# Altium schematic sheet SCH_System.SchDoc
size A4
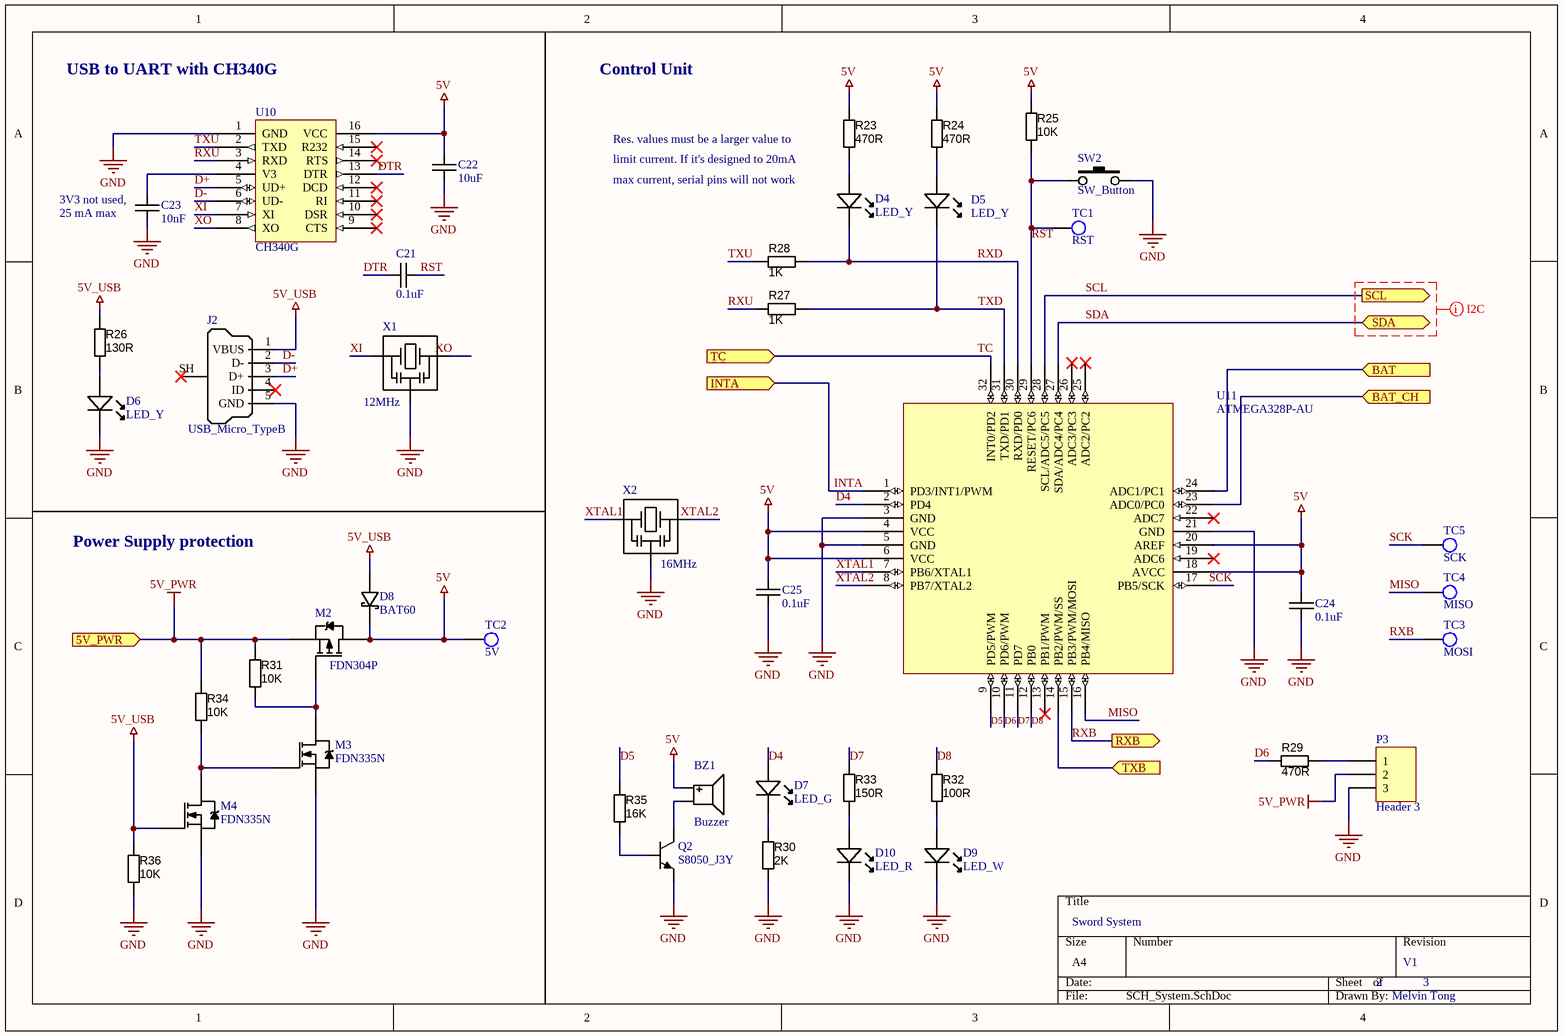
[diagram p0: SCH_System.SchDoc]

## Parts
BZ1  Buzzer  [Buzzer]
C21  0.1uF  [CAP_0805]
C22  10uF  [CAP_1206]
C23  10nF  [CAP_0805]
C24  0.1uF  [CAP_0805]
C25  0.1uF  [CAP_0805]
D4  LED_Y  [LED-0603-YELLOW]
D5  LED_Y  [LED-0603-YELLOW]
D6  LED_Y  [LED-0603-YELLOW]
D7  LED_G  [LED_0805]
D8  BAT60  [SOD323]
D9  LED_W  [LED_0805]
D10  LED_R  [LED_0805]
J2  USB_Micro_TypeB  [USB_Micro_TypeB]
M2  FDN304P  [SOT23_213]
M3  FDN335N  [SOT23_213]
M4  FDN335N  [SOT23_213]
P3  Header 3  [HDR1X3]
Q2  S8050_J3Y  [SOT23_213]
R23  470R  [RESC3216X70N]
R24  470R  [RESC3216X70N]
R25  10K  [RESC3216X70N]
R26  130R  [RESC3216X70N]
R27  1K  [RESC3216X70N]
R28  1K  [RESC3216X70N]
R29  470R  [RESC3216X70N]
R30  2K  [RESC3216X70N]
R31  10K  [RESC3216X70N]
R32  100R  [RESC3216X70N]
R33  150R  [RESC3216X70N]
R34  10K  [RESC3216X70N]
R35  16K  [RESC3216X70N]
R36  10K  [RESC3216X70N]
SW2  SW_Button  [Button_4x4x1.5]
TC1  RST  [TP_15]
TC2  5V  [TP_15]
TC3  MOSI  [TP_15]
TC4  MISO  [TP_15]
TC5  SCK  [TP_15]
U10  CH340G  [CH340G]
U11  ATMEGA328P-AU  [ATMEGA328P-AU]
X1  12MHz  [XTAL_3.2x1.6]
X2  16MHz  [XTAL_16MHz]

## Ports
5V_PWR (in), BAT (in), BAT_CH (in), INTA (in), RXB (out), SCL (out), SDA (bidir), TC (in), TXB (in)

## Nets
5V: BZ1.1(Positive) C22.1 C24.2 C25.2 D8.K M2.3(D) R23.2 R24.1 R25.1 TC2.1 U10.16(VCC) U11.4(VCC) U11.6(VCC) U11.18(AVCC) U11.20(AREF)
5V_PWR: M2.2(S) P3.2 R31.1 R34.1 ; port 5V_PWR
5V_USB: D8.A J2.1(VBUS) M4.1(G) R26.2 R36.1
GND: C22.2 C23.2 C24.1 C25.1 D6.K D9.K D10.K J2.5(GND) M3.2(S) M4.2(S) P3.3 Q2.2(E) R30.2 R36.2 SW2.2 U10.1(GND) U11.3(GND) U11.5(GND) U11.21(GND) X1.2(GND) X2.2(GND)
BAT: U11.24(ADC1/PC1) ; port BAT
BAT_CH: U11.23(ADC0/PC0) ; port BAT_CH
D4: D7.A U11.2(PD4)
D5: R35.1 U11.9(PD5/PWM)
D6: R29.2 U11.10(PD6/PWM)
D7: R33.1 U11.11(PD7)
D8: R32.2 U11.12(PB0)
D+: J2.3(D+) U10.5(UD+)
D-: J2.2(D-) U10.6(UD-)
DTR: C21.1 U10.13(DTR)
INTA: U11.1(PD3/INT1/PWM) ; port INTA
MISO: TC4.1 U11.16(PB4/MISO)
RST: C21.2 R25.2 SW2.1 TC1.1 U11.29(RESET/PC6)
RXB: TC3.1 U11.15(PB3/PWM/MOSI) ; port RXB
RXD: D4.K R28.2 U11.30(RXD/PD0)
RXU: R27.1 U10.3(RXD)
SCK: TC5.1 U11.17(PB5/SCK)
SCL: U11.28(SCL/ADC5/PC5) ; port SCL
SDA: U11.27(SDA/ADC4/PC4) ; port SDA
TC: U11.32(INT0/PD2) ; port TC
TXB: U11.14(PB2/PWM/SS) ; port TXB
TXD: D5.K R27.2 U11.31(TXD/PD1)
TXU: R28.1 U10.2(TXD)
XI: U10.7(XI) X1.1(IN)
XO: U10.8(XO) X1.3(OUT)
XTAL1: U11.7(PB6/XTAL1) X2.1(IN)
XTAL2: U11.8(PB7/XTAL2) X2.3(OUT)
NetBZ1_2: BZ1.2(Negative) Q2.3(C)
NetC23_1: C23.1 U10.4(V3)
NetD4_A: D4.A R23.1
NetD5_A: D5.A R24.2
NetD6_A: D6.A R26.1
NetD7_K: D7.K R30.1
NetD9_A: D9.A R32.1
NetD10_A: D10.A R33.2
NetM2_1: M2.1(G) M3.3(D) R31.2
NetM3_1: M3.1(G) M4.3(D) R34.2
NetP3_1: P3.1 R29.1
NetQ2_1: Q2.1(B) R35.2

Not connected (* = marked no-connect by the designer): J2 4(ID)* SH(Shell)*; U10 9(CTS)* 10(DSR)* 11(RI)* 12(DCD)* 14(RTS)* 15(R232)*; U11 13(PB1/PWM)* 19(ADC6)* 22(ADC7)* 25(ADC2/PC2)* 26(ADC3/PC3)*

## Layout directives
net class I2C: (no net found under the mark)

## Notes on the sheet
- USB to UART with CH340G
- Control Unit
- (near R23) Res. values must be a larger value to
- (near R23) limit current. If it's designed to 20mA
- (near C23) 3V3 not used,
- (near C23) 25 mA max
- (near D4) max current, serial pins will not work
- Power Supply protection
- Sword System
- 2
- V1
- 3
- Melvin Tong

## Library data of the parts
BZ1 = Buzzer: Buzzer passive 5 VAC
C21 C24 C25 = CAP_0.1uF: SMD 0805
C22 = CAP_10uF: SMD 0805/1206
C23 = CAP_10nF: SMD 0805
D4-D6 = LED_Y: SMD_0603 2.4V
D7 = LED_G: SMD_0805 3V
D8 = BAT60: Schottky Diode 3A, Vf~0.24V, Vr=10V
D9 = LED_W: SMD_0805 3V
D10 = LED_R: SMD_0805 2V
M2 = PMOS
M3 M4 = NMOS
P3 = Header 3: Header, 3-Pin; LatestRevisionDate: 17-Jul-2002; LatestRevisionNote: Re-released for DXP Platform.; Publisher: Altium Limited
Q2 = NPN
R23 R24 R29 = RES_470R: Resistor SMD, 1206; Value: N/A
R25 R31 R34 R36 = RES_10K: Resistor SMD, 1206; Value: N/A
R26 = RES_130R: Resistor SMD, 1206; Value: N/A
R27 R28 = RES_1K: Resistor SMD, 1206; Value: N/A
R30 = RES_2K: Resistor SMD, 1206; Value: N/A
R32 = RES_100R: Resistor SMD, 1206; Value: N/A
R33 = RES_150R: Resistor SMD, 1206; Value: N/A
R35 = RES_16K: Resistor SMD, 1206; Value: N/A
TC1-TC5 = TESTCONN
X1 = 12MHz: Crystal Oscillator
X2 = 16MHz: Crystal Oscillator